# Altium schematic sheet LineSensors.SchDoc: Line Sensors
size A4; Date: 2022 Fall; Address1: LK Bulls; Address2: Bagoly Zoltan; Address3: Feher Daniel; Address4: G. Varga Gabor; DocumentNumber: 3; Revision: 1.0; SheetNumber: 3; SheetTotal: 14
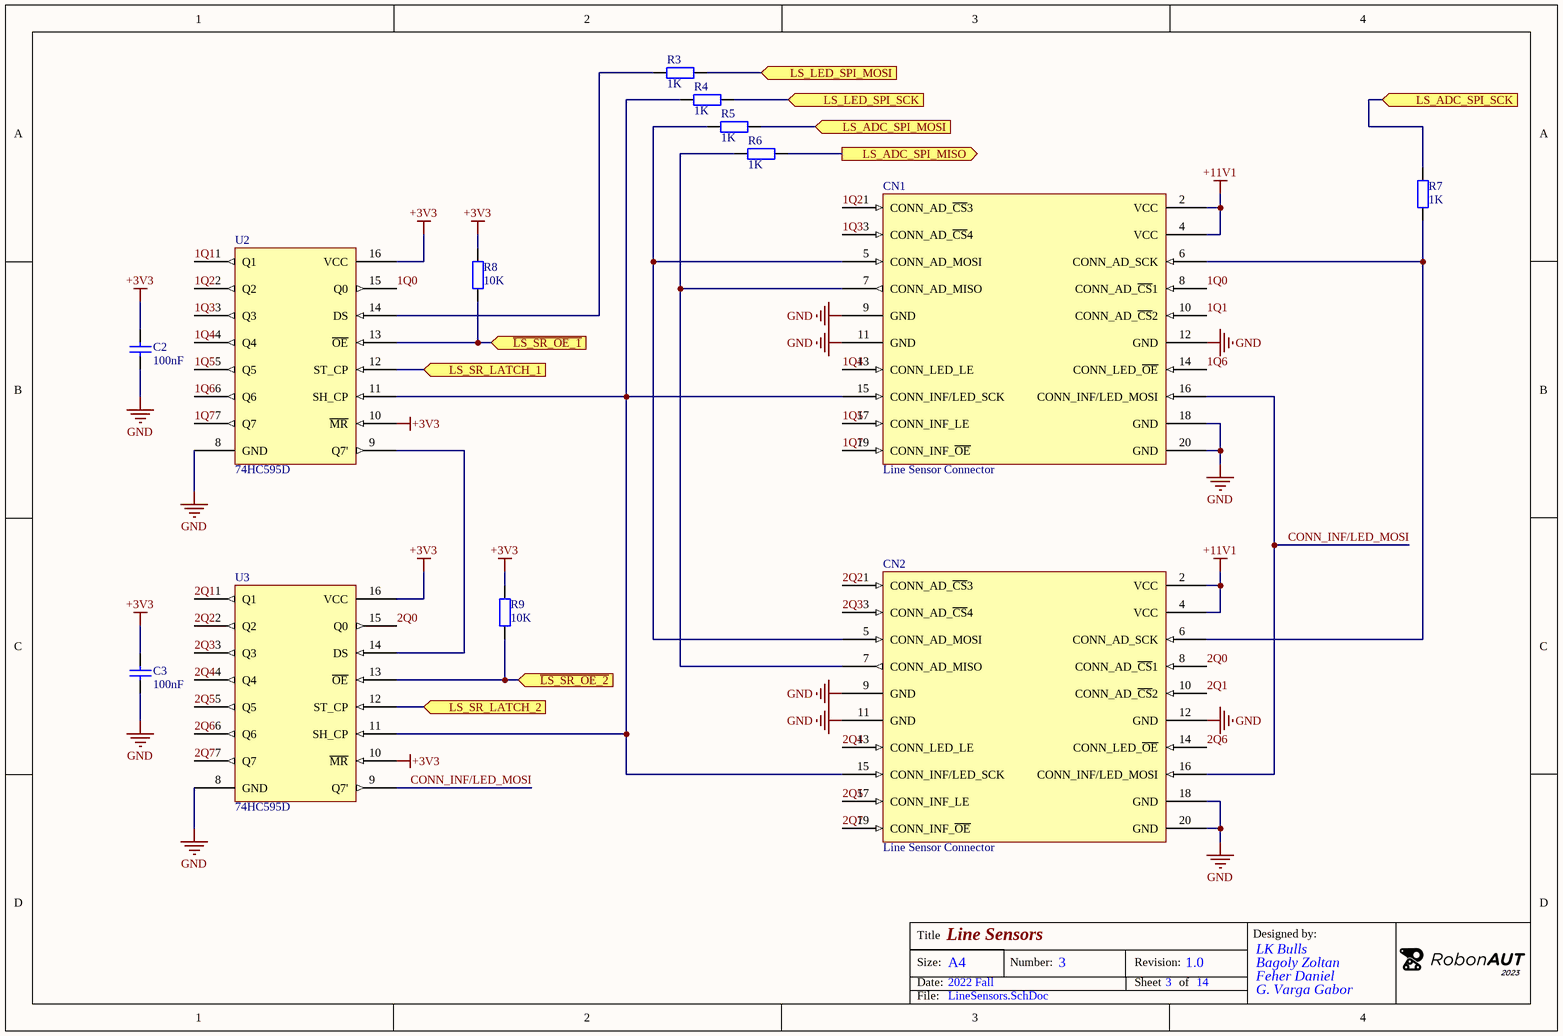
[diagram p0: LineSensors.SchDoc]

## Parts
C2  100nF  [FP_0805_CAP_085]
C3  100nF  [FP_0805_CAP_085]
CN1  Line Sensor Connector  [CONNECTOR-20P]
CN2  Line Sensor Connector  [CONNECTOR-20P]
R3  1K  [FP_0805_RES]
R4  1K  [FP_0805_RES]
R5  1K  [FP_0805_RES]
R6  1K  [FP_0805_RES]
R7  1K  [FP_0805_RES]
R8  10K  [FP_0805_RES]
R9  10K  [FP_0805_RES]
U2  74HC595D  [SO16]
U3  74HC595D  [SO16]

## Ports
LS_ADC_SPI_MISO (out), LS_ADC_SPI_MOSI (in), LS_ADC_SPI_SCK (in), LS_LED_SPI_MOSI (in), LS_LED_SPI_SCK (in), LS_SR_LATCH_1 (in), LS_SR_LATCH_2 (in), ~{LS_SR_OE_1} (in), ~{LS_SR_OE_2} (in)

## Nets
+3V3: C2.2 C3.2 R8.2 R9.2 U2.10(~{MR}) U2.16(VCC) U3.10(~{MR}) U3.16(VCC)
+11V1: CN1.2(VCC) CN1.4(VCC) CN2.2(VCC) CN2.4(VCC)
GND: C2.1 C3.1 CN1.9(GND) CN1.11(GND) CN1.12(GND) CN1.18(GND) CN1.20(GND) CN2.9(GND) CN2.11(GND) CN2.12(GND) CN2.18(GND) CN2.20(GND) U2.8(GND) U3.8(GND)
1Q0: CN1.8(CONN_AD_~{CS}1) U2.15(Q0)
1Q1: CN1.10(CONN_AD_~{CS}2) U2.1(Q1)
1Q2: CN1.1(CONN_AD_~{CS}3) U2.2(Q2)
1Q3: CN1.3(CONN_AD_~{CS}4) U2.3(Q3)
1Q4: CN1.13(CONN_LED_LE) U2.4(Q4)
1Q5: CN1.17(CONN_INF_LE) U2.5(Q5)
1Q6: CN1.14(CONN_LED_~{OE}) U2.6(Q6)
1Q7: CN1.19(CONN_INF_~{OE}) U2.7(Q7)
2Q0: CN2.8(CONN_AD_~{CS}1) U3.15(Q0)
2Q1: CN2.10(CONN_AD_~{CS}2) U3.1(Q1)
2Q2: CN2.1(CONN_AD_~{CS}3) U3.2(Q2)
2Q3: CN2.3(CONN_AD_~{CS}4) U3.3(Q3)
2Q4: CN2.13(CONN_LED_LE) U3.4(Q4)
2Q5: CN2.17(CONN_INF_LE) U3.5(Q5)
2Q6: CN2.14(CONN_LED_~{OE}) U3.6(Q6)
2Q7: CN2.19(CONN_INF_~{OE}) U3.7(Q7)
CONN_INF/LED_MOSI: CN1.16(CONN_INF/LED_MOSI) CN2.16(CONN_INF/LED_MOSI) U3.9(Q7')
~{LS_SR_OE_1}: R8.1 U2.13(~{OE}) ; port ~{LS_SR_OE_1}
~{LS_SR_OE_2}: R9.1 U3.13(~{OE}) ; port ~{LS_SR_OE_2}
LS_ADC_SPI_MISO: R6.2 ; port LS_ADC_SPI_MISO
LS_ADC_SPI_MOSI: R5.2 ; port LS_ADC_SPI_MOSI
LS_ADC_SPI_SCK: R7.2 ; port LS_ADC_SPI_SCK
LS_LED_SPI_MOSI: R3.2 ; port LS_LED_SPI_MOSI
LS_LED_SPI_SCK: R4.2 ; port LS_LED_SPI_SCK
LS_SR_LATCH_1: U2.12(ST_CP) ; port LS_SR_LATCH_1
LS_SR_LATCH_2: U3.12(ST_CP) ; port LS_SR_LATCH_2
NetCN1_5: CN1.5(CONN_AD_MOSI) CN2.5(CONN_AD_MOSI) R5.1
NetCN1_6: CN1.6(CONN_AD_SCK) CN2.6(CONN_AD_SCK) R7.1
NetCN1_7: CN1.7(CONN_AD_MISO) CN2.7(CONN_AD_MISO) R6.1
NetCN1_15: CN1.15(CONN_INF/LED_SCK) CN2.15(CONN_INF/LED_SCK) R4.1 U2.11(SH_CP) U3.11(SH_CP)
NetR3_1: R3.1 U2.14(DS)
NetU2_9: U2.9(Q7') U3.14(DS)

## Notes on the sheet
- Title
- Size:
- Date:
- A4
- Number:
- Revision:
- Sheet
- of
- Designed by:
- File:

## Library data of the parts
C2 C3 = CAP: Capacitor; Tolerance: 10%; Voltage: 50V; Name: 100nF 0805 10% 50V X7R 0805B104K500NT (FNG); Supplier: Lomex; Reference: 82-13-46; Value: 100nF
CN1 CN2 = Connector_Line_Sensor: Name: SZAL.KABEL 20 P APA 90° BHR-20 (T-T); Supplier: Lomex; Reference: 43-01-11
R3-R7 = RES: Resistor; Tolerance: 5%; Power: 0.125W; Name: 1K00 0805 5% CR-05JL7----1K 0.125W (VIK); Supplier: Lomex; Reference: 81-10-87; Value: 1K
R8 R9 = RES: Resistor; Tolerance: 5%; Power: 0.125W; Name: 10K0 0805 5% CR-05JL7---10K 0.125W (VIK); Supplier: Lomex; Reference: 81-10-99; Value: 10K
U2 U3 = 74HC595D: 8-bit serial-in, serial or parallel-out shift register with output latches; 3-state; Name: 74HC595D,118 (NXP) 8-BIT SHIFT-REGISTER WITH OUTPUT LATCH SO-16; Supplier: Lomex; Reference: 87-01-20